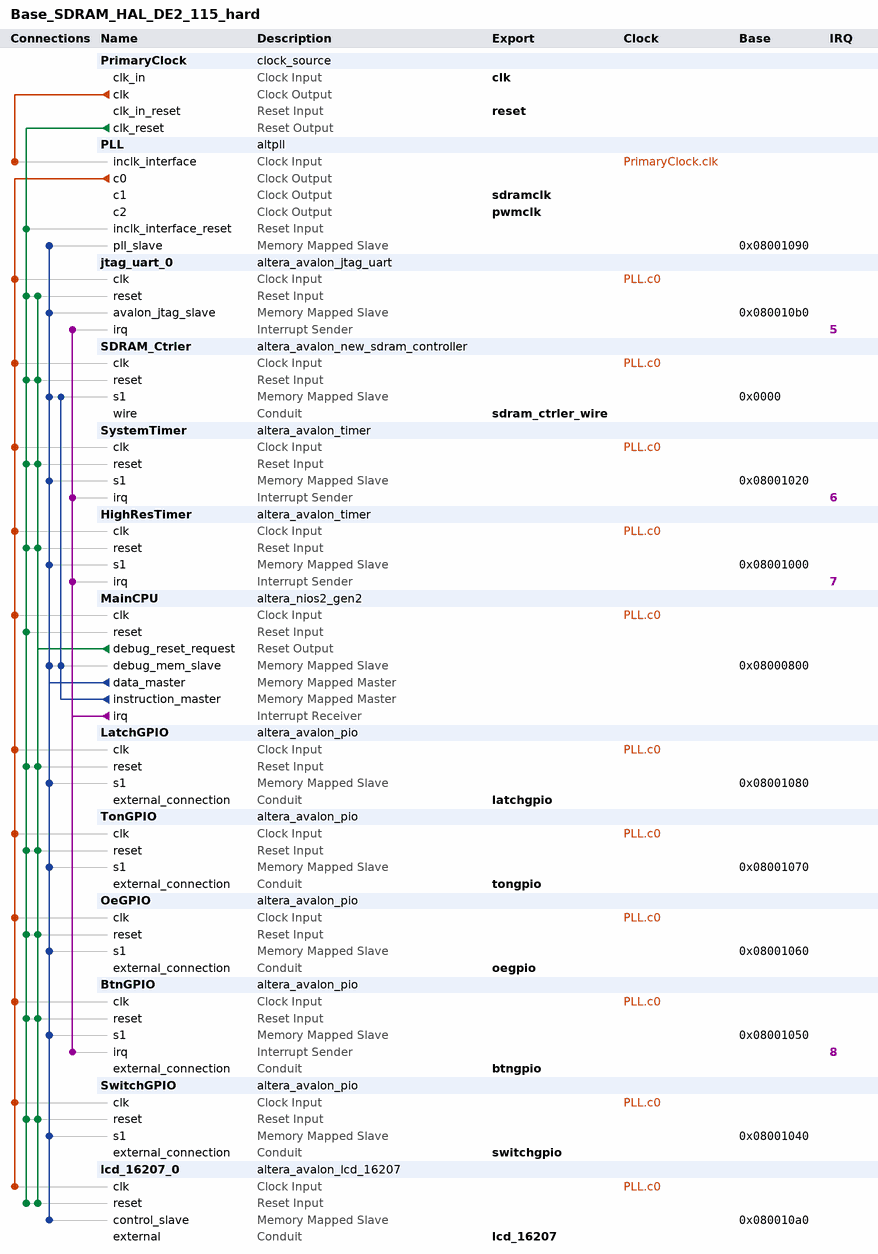
[diagram p0: system contents]
# Platform Designer (Qsys) system Base_SDRAM_HAL_DE2_115_hard, Cyclone IV E EP4CE115F29C7
# Parameters at their usual value, and those the tool derives, are not listed.
package require -exact qsys 17.1
create_system Base_SDRAM_HAL_DE2_115_hard
set_project_property DEVICE_FAMILY {Cyclone IV E}
set_project_property DEVICE EP4CE115F29C7

add_instance PrimaryClock clock_source 17.1
set_instance_parameter_value PrimaryClock clockFrequency 50000000

add_instance PLL altpll 17.1
set_instance_parameter_value PLL CLK0_DIVIDE_BY 1
set_instance_parameter_value PLL CLK0_MULTIPLY_BY 2
set_instance_parameter_value PLL CLK1_DIVIDE_BY 1
set_instance_parameter_value PLL CLK1_DUTY_CYCLE 50
set_instance_parameter_value PLL CLK1_MULTIPLY_BY 2
set_instance_parameter_value PLL CLK1_PHASE_SHIFT -1667
set_instance_parameter_value PLL CLK2_DIVIDE_BY 3125
set_instance_parameter_value PLL CLK2_DUTY_CYCLE 50
set_instance_parameter_value PLL CLK2_MULTIPLY_BY 64
set_instance_parameter_value PLL CLK2_PHASE_SHIFT 0
set_instance_parameter_value PLL INCLK0_INPUT_FREQUENCY 20000
set_instance_parameter_value PLL PORT_ARESET PORT_UNUSED
set_instance_parameter_value PLL PORT_LOCKED PORT_UNUSED
set_instance_parameter_value PLL PORT_clk1 PORT_USED
set_instance_parameter_value PLL PORT_clk2 PORT_USED
set_instance_parameter_value PLL PORT_clk3 PORT_UNUSED

add_instance jtag_uart_0 altera_avalon_jtag_uart 17.1
set_instance_parameter_value jtag_uart_0 simInteractiveOptions NO_INTERACTIVE_WINDOWS

add_instance SDRAM_Ctrler altera_avalon_new_sdram_controller 17.1
set_instance_parameter_value SDRAM_Ctrler TAC 5.5
set_instance_parameter_value SDRAM_Ctrler TRCD 20.0
set_instance_parameter_value SDRAM_Ctrler TRP 20.0
set_instance_parameter_value SDRAM_Ctrler casLatency 3
set_instance_parameter_value SDRAM_Ctrler columnWidth 10
set_instance_parameter_value SDRAM_Ctrler dataWidth 32
set_instance_parameter_value SDRAM_Ctrler generateSimulationModel false
set_instance_parameter_value SDRAM_Ctrler model single_Micron_MT48LC4M32B2_7_chip
set_instance_parameter_value SDRAM_Ctrler numberOfBanks 4
set_instance_parameter_value SDRAM_Ctrler numberOfChipSelects 1
set_instance_parameter_value SDRAM_Ctrler powerUpDelay 200.0
set_instance_parameter_value SDRAM_Ctrler refreshPeriod 7.8125
set_instance_parameter_value SDRAM_Ctrler rowWidth 13

add_instance SystemTimer altera_avalon_timer 17.1
set_instance_parameter_value SystemTimer period 1
set_instance_parameter_value SystemTimer periodUnits MSEC

add_instance HighResTimer altera_avalon_timer 17.1
set_instance_parameter_value HighResTimer period 1
set_instance_parameter_value HighResTimer periodUnits USEC

add_instance MainCPU altera_nios2_gen2 17.1
set_instance_parameter_value MainCPU dcache_size 2048
set_instance_parameter_value MainCPU exceptionSlave SDRAM_Ctrler.s1
set_instance_parameter_value MainCPU icache_size 4096
set_instance_parameter_value MainCPU impl Tiny
set_instance_parameter_value MainCPU resetSlave SDRAM_Ctrler.s1

add_instance LatchGPIO altera_avalon_pio 17.1
set_instance_parameter_value LatchGPIO direction Output
set_instance_parameter_value LatchGPIO width 24

add_instance TonGPIO altera_avalon_pio 17.1
set_instance_parameter_value TonGPIO direction Output
set_instance_parameter_value TonGPIO width 10

add_instance OeGPIO altera_avalon_pio 17.1
set_instance_parameter_value OeGPIO direction Output
set_instance_parameter_value OeGPIO width 24

add_instance BtnGPIO altera_avalon_pio 17.1
set_instance_parameter_value BtnGPIO captureEdge true
set_instance_parameter_value BtnGPIO direction Input
set_instance_parameter_value BtnGPIO edgeType FALLING
set_instance_parameter_value BtnGPIO generateIRQ true
set_instance_parameter_value BtnGPIO irqType EDGE
set_instance_parameter_value BtnGPIO width 24

add_instance SwitchGPIO altera_avalon_pio 17.1
set_instance_parameter_value SwitchGPIO direction Input
set_instance_parameter_value SwitchGPIO width 2

add_instance lcd_16207_0 altera_avalon_lcd_16207 17.1

# connections
add_connection PLL.c0 BtnGPIO.clk clock
add_connection PLL.c0 HighResTimer.clk clock
add_connection PLL.c0 jtag_uart_0.clk clock
add_connection PLL.c0 LatchGPIO.clk clock
add_connection PLL.c0 lcd_16207_0.clk clock
add_connection PLL.c0 MainCPU.clk clock
add_connection PLL.c0 OeGPIO.clk clock
add_connection PLL.c0 SDRAM_Ctrler.clk clock
add_connection PLL.c0 SwitchGPIO.clk clock
add_connection PLL.c0 SystemTimer.clk clock
add_connection PLL.c0 TonGPIO.clk clock
add_connection PrimaryClock.clk PLL.inclk_interface clock
add_connection MainCPU.debug_reset_request BtnGPIO.reset reset
add_connection MainCPU.debug_reset_request HighResTimer.reset reset
add_connection MainCPU.debug_reset_request jtag_uart_0.reset reset
add_connection MainCPU.debug_reset_request LatchGPIO.reset reset
add_connection MainCPU.debug_reset_request lcd_16207_0.reset reset
add_connection MainCPU.debug_reset_request OeGPIO.reset reset
add_connection MainCPU.debug_reset_request SDRAM_Ctrler.reset reset
add_connection MainCPU.debug_reset_request SwitchGPIO.reset reset
add_connection MainCPU.debug_reset_request SystemTimer.reset reset
add_connection MainCPU.debug_reset_request TonGPIO.reset reset
add_connection PrimaryClock.clk_reset BtnGPIO.reset reset
add_connection PrimaryClock.clk_reset HighResTimer.reset reset
add_connection PrimaryClock.clk_reset jtag_uart_0.reset reset
add_connection PrimaryClock.clk_reset LatchGPIO.reset reset
add_connection PrimaryClock.clk_reset lcd_16207_0.reset reset
add_connection PrimaryClock.clk_reset MainCPU.reset reset
add_connection PrimaryClock.clk_reset OeGPIO.reset reset
add_connection PrimaryClock.clk_reset PLL.inclk_interface_reset reset
add_connection PrimaryClock.clk_reset SDRAM_Ctrler.reset reset
add_connection PrimaryClock.clk_reset SwitchGPIO.reset reset
add_connection PrimaryClock.clk_reset SystemTimer.reset reset
add_connection PrimaryClock.clk_reset TonGPIO.reset reset
add_connection MainCPU.data_master BtnGPIO.s1 avalon
set_connection_parameter_value MainCPU.data_master/BtnGPIO.s1 baseAddress 0x08001050
add_connection MainCPU.data_master HighResTimer.s1 avalon
set_connection_parameter_value MainCPU.data_master/HighResTimer.s1 baseAddress 0x08001000
add_connection MainCPU.data_master jtag_uart_0.avalon_jtag_slave avalon
set_connection_parameter_value MainCPU.data_master/jtag_uart_0.avalon_jtag_slave baseAddress 0x080010b0
add_connection MainCPU.data_master LatchGPIO.s1 avalon
set_connection_parameter_value MainCPU.data_master/LatchGPIO.s1 baseAddress 0x08001080
add_connection MainCPU.data_master lcd_16207_0.control_slave avalon
set_connection_parameter_value MainCPU.data_master/lcd_16207_0.control_slave baseAddress 0x080010a0
add_connection MainCPU.data_master MainCPU.debug_mem_slave avalon
set_connection_parameter_value MainCPU.data_master/MainCPU.debug_mem_slave baseAddress 0x08000800
add_connection MainCPU.data_master OeGPIO.s1 avalon
set_connection_parameter_value MainCPU.data_master/OeGPIO.s1 baseAddress 0x08001060
add_connection MainCPU.data_master PLL.pll_slave avalon
set_connection_parameter_value MainCPU.data_master/PLL.pll_slave baseAddress 0x08001090
add_connection MainCPU.data_master SDRAM_Ctrler.s1 avalon
set_connection_parameter_value MainCPU.data_master/SDRAM_Ctrler.s1 baseAddress 0x0000
add_connection MainCPU.data_master SwitchGPIO.s1 avalon
set_connection_parameter_value MainCPU.data_master/SwitchGPIO.s1 baseAddress 0x08001040
add_connection MainCPU.data_master SystemTimer.s1 avalon
set_connection_parameter_value MainCPU.data_master/SystemTimer.s1 baseAddress 0x08001020
add_connection MainCPU.data_master TonGPIO.s1 avalon
set_connection_parameter_value MainCPU.data_master/TonGPIO.s1 baseAddress 0x08001070
add_connection MainCPU.instruction_master MainCPU.debug_mem_slave avalon
set_connection_parameter_value MainCPU.instruction_master/MainCPU.debug_mem_slave baseAddress 0x08000800
add_connection MainCPU.instruction_master SDRAM_Ctrler.s1 avalon
set_connection_parameter_value MainCPU.instruction_master/SDRAM_Ctrler.s1 baseAddress 0x0000
add_connection MainCPU.irq BtnGPIO.irq interrupt
set_connection_parameter_value MainCPU.irq/BtnGPIO.irq irqNumber 8
add_connection MainCPU.irq HighResTimer.irq interrupt
set_connection_parameter_value MainCPU.irq/HighResTimer.irq irqNumber 7
add_connection MainCPU.irq jtag_uart_0.irq interrupt
set_connection_parameter_value MainCPU.irq/jtag_uart_0.irq irqNumber 5
add_connection MainCPU.irq SystemTimer.irq interrupt
set_connection_parameter_value MainCPU.irq/SystemTimer.irq irqNumber 6

# exported interfaces
add_interface btngpio conduit end
set_interface_property btngpio EXPORT_OF BtnGPIO.external_connection
add_interface clk clock sink
set_interface_property clk EXPORT_OF PrimaryClock.clk_in
add_interface latchgpio conduit end
set_interface_property latchgpio EXPORT_OF LatchGPIO.external_connection
add_interface lcd_16207 conduit end
set_interface_property lcd_16207 EXPORT_OF lcd_16207_0.external
add_interface oegpio conduit end
set_interface_property oegpio EXPORT_OF OeGPIO.external_connection
add_interface pwmclk clock source
set_interface_property pwmclk EXPORT_OF PLL.c2
add_interface reset reset sink
set_interface_property reset EXPORT_OF PrimaryClock.clk_in_reset
add_interface sdram_ctrler_wire conduit end
set_interface_property sdram_ctrler_wire EXPORT_OF SDRAM_Ctrler.wire
add_interface sdramclk clock source
set_interface_property sdramclk EXPORT_OF PLL.c1
add_interface switchgpio conduit end
set_interface_property switchgpio EXPORT_OF SwitchGPIO.external_connection
add_interface tongpio conduit end
set_interface_property tongpio EXPORT_OF TonGPIO.external_connection

set_interconnect_requirement {$system} qsys_mm.clockCrossingAdapter HANDSHAKE
set_interconnect_requirement {$system} qsys_mm.enableEccProtection FALSE
set_interconnect_requirement {$system} qsys_mm.insertDefaultSlave FALSE
set_interconnect_requirement {$system} qsys_mm.maxAdditionalLatency 1

save_system Base_SDRAM_HAL_DE2_115_hard.qsys
